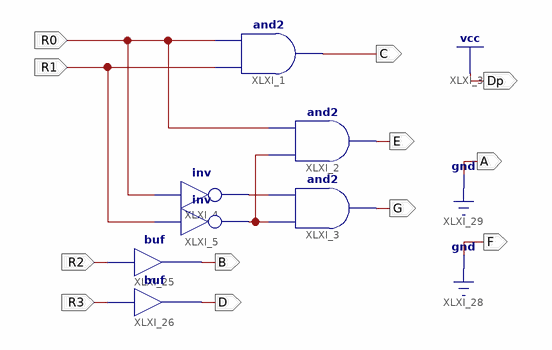
[diagram p0: schematic sheet 1]
// Xilinx ISE schematic kadai.sch (spartan6) as structural Verilog: 7 symbols, 12 ports
module kadai (
  input  R0,
  input  R1,
  input  R2,
  input  R3,
  output C,
  output E,
  output G,
  output B,
  output D,
  output A,
  output F,
  output Dp
);

  wire XLXN_45, XLXN_46;

  and XLXI_1 (C, R1, R0);
  and XLXI_2 (E, XLXN_45, R0);
  and XLXI_3 (G, XLXN_45, XLXN_46);
  not XLXI_4 (XLXN_46, R0);
  not XLXI_5 (XLXN_45, R1);
  buf XLXI_25 (B, R2);
  buf XLXI_26 (D, R3);

  assign A = 1'b0;
  assign Dp = 1'b1;
  assign F = 1'b0;
endmodule
